# EAGLE design BC840M (EAGLE 9.6.2)

## Sheet 1 of 3
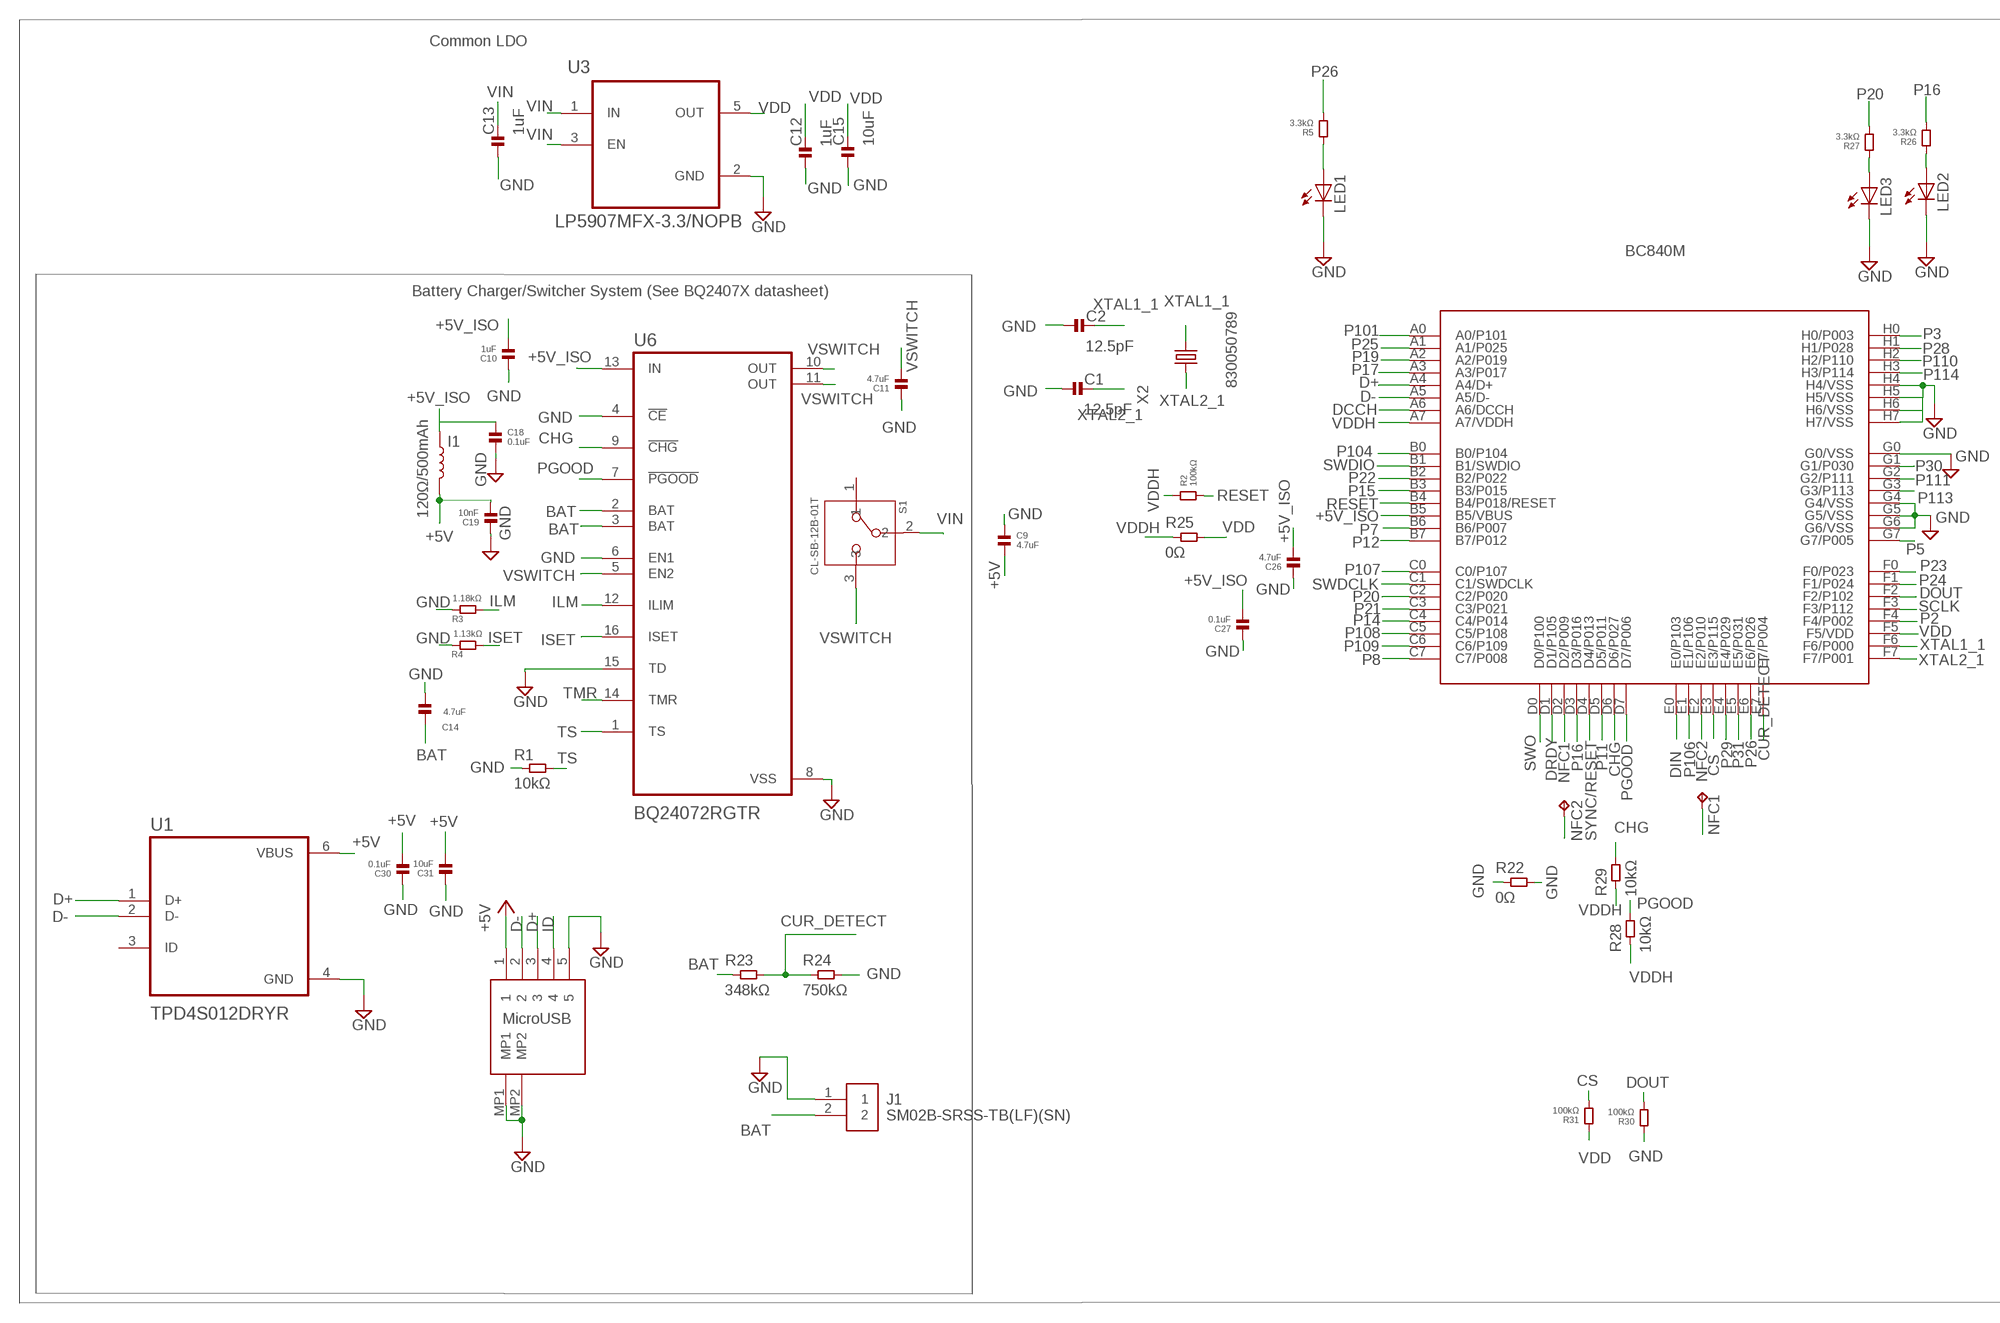
[diagram p0: schematic, sheet 1, part 1 of 2]
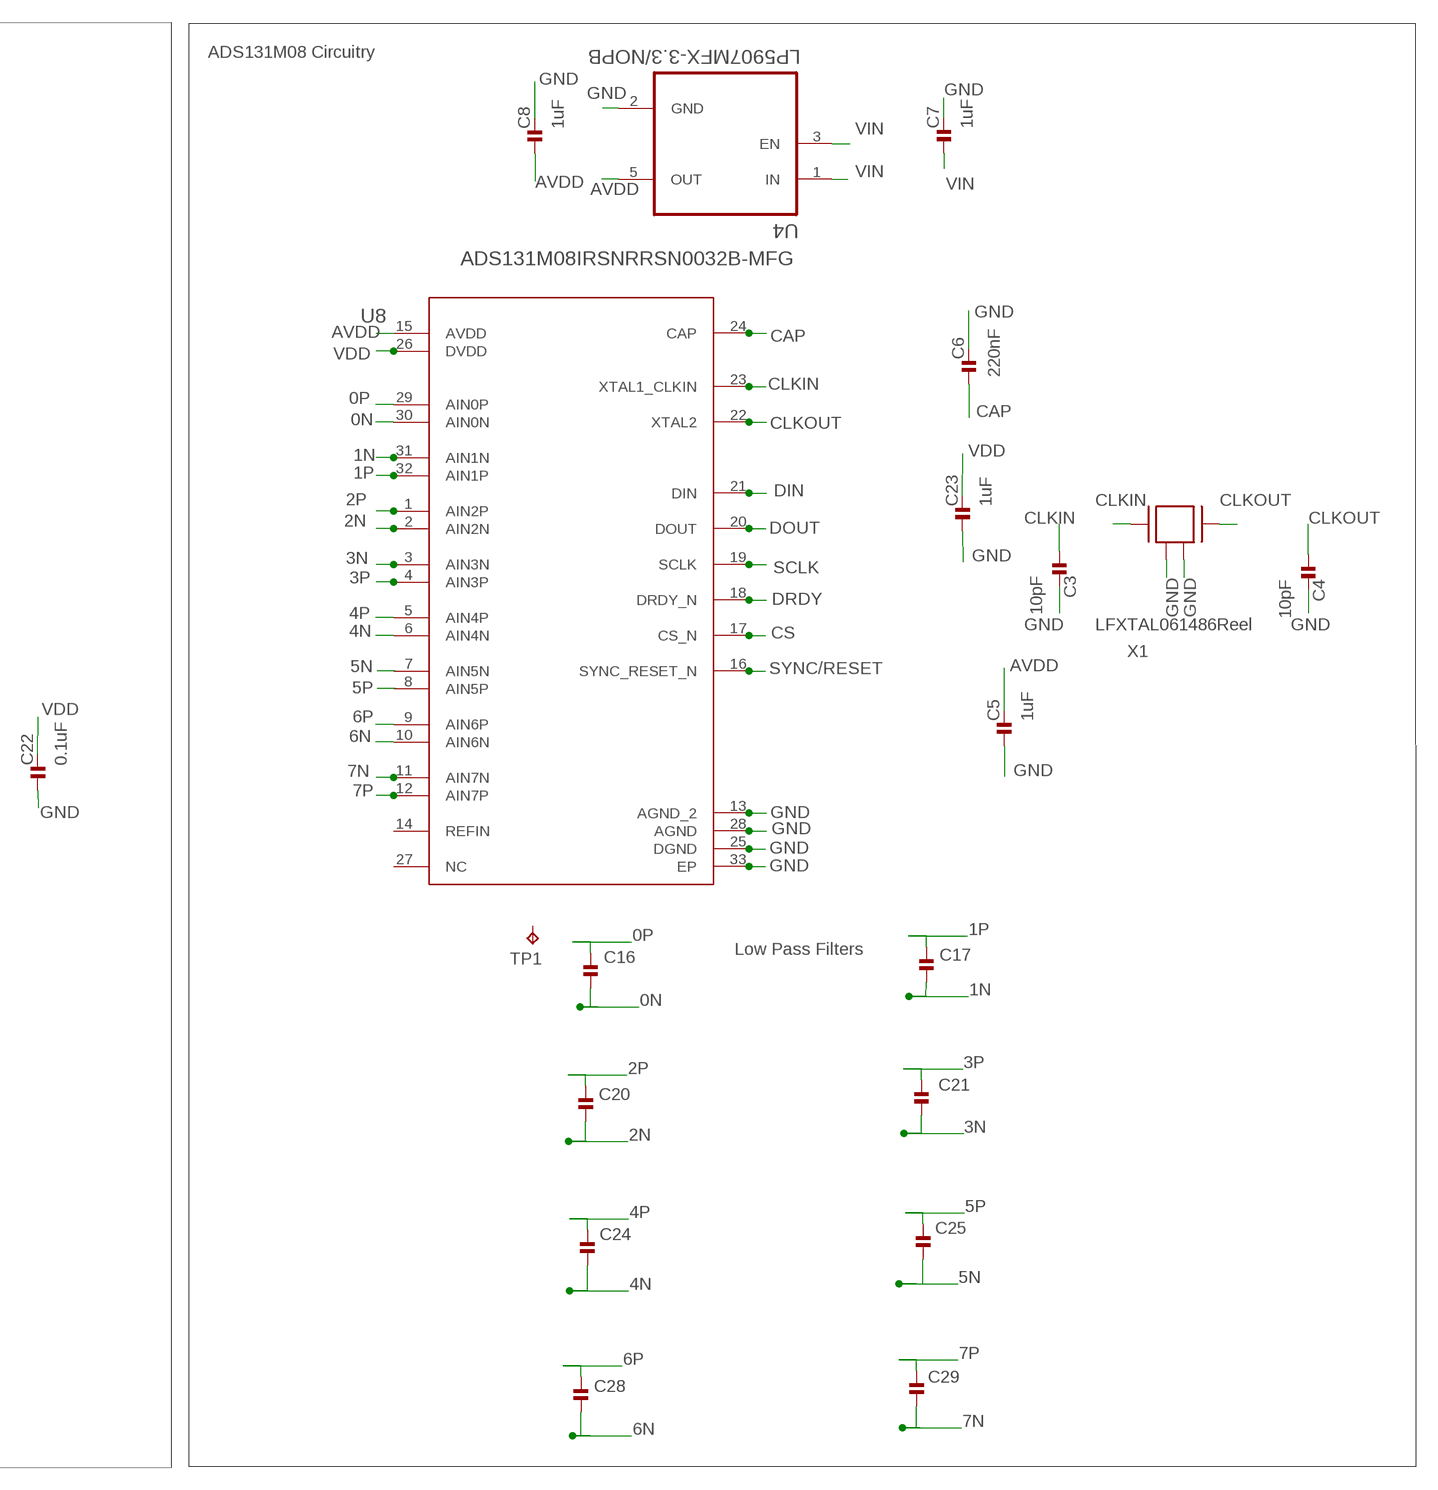
[diagram p1: schematic, sheet 1, part 2 of 2]

### Parts
C1  12.5pF  CAPACITOR.0201  [0201]
C2  12.5pF  CAPACITOR.0201  [0201]
C3  10pF  CAPACITOR.0201  [0201]
C4  10pF  CAPACITOR.0201  [0201]
C5  1uF  CAPACITOR.0201  [0201]
C6  220nF  CAPACITOR.0201  [0201]
C7  1uF  CAPACITOR.0201  [0201]
C8  1uF  CAPACITOR.0201  [0201]
C9  4.7uF  CAPACITOR.0201  [0201]
C10  1uF  CAPACITOR.0201  [0201]
C11  4.7uF  CAPACITOR.0201  [0201]
C12  1uF  CAPACITOR.0201  [0201]
C13  1uF  CAPACITOR.0201  [0201]
C14  4.7uF  CAPACITOR.0201  [0201]
C15  10uF  CAPACITOR.0402  [0402]
C16  100pF  CAPACITOR.0201  [0201]
C17  100pF  CAPACITOR.0201  [0201]
C18  0.1uF  CAPACITOR.0201  [0201]
C19  10nF  CAPACITOR.0201  [0201]
C20  100pF  CAPACITOR.0201  [0201]
C21  100pF  CAPACITOR.0201  [0201]
C22  0.1uF  CAPACITOR.0201  [0201]
C23  1uF  CAPACITOR.0201  [0201]
C24  100pF  CAPACITOR.0201  [0201]
C25  100pF  CAPACITOR.0201  [0201]
C26  4.7uF  CAPACITOR.0201  [0201]
C27  0.1uF  CAPACITOR.0201  [0201]
C28  100pF  CAPACITOR.0201  [0201]
C29  100pF  CAPACITOR.0201  [0201]
C30  0.1uF  CAPACITOR.0201  [0201]
C31  10uF  CAPACITOR.0402  [0402]
I1  120Ω/500mAh  12NH-0402  [0402_COILCRAFT]
J1  SM02B-SRSS-TB(LF)(SN)  [SM02B-SRSS-TB(LF)(SN)]
LED1  LEDCHIPLED_0603  [CHIPLED_0603]
LED2  LEDCHIPLED_0603  [CHIPLED_0603]
LED3  LEDCHIPLED_0603  [CHIPLED_0603]
NFC1  TPTP14SQ  [TP14SQ]
NFC2  TPTP14SQ  [TP14SQ]
R1  10kΩ  RESISTOR.0201  [0201]
R2  100kΩ  RESISTOR.0201  [0201]
R3  1.18kΩ  RESISTOR.0603  [0603]
R4  1.13kΩ  RESISTOR.0603  [0603]
R5  3.3kΩ  RESISTOR.0201  [0201]
R22  0Ω  RESISTOR.0805  [0805]
R23  348kΩ  RESISTOR.0603  [0603]
R24  750kΩ  RESISTOR.0603  [0603]
R25  0Ω  RESISTOR.0805  [0805]
R26  3.3kΩ  RESISTOR.0201  [0201]
R27  3.3kΩ  RESISTOR.0201  [0201]
R28  10kΩ  RESISTOR.0402  [0402]
R29  10kΩ  RESISTOR.0402  [0402]
R30  100kΩ  RESISTOR.0402  [0402]
R31  100kΩ  RESISTOR.0402  [0402]
S1  CL-SB-12B-01T  [CL-SB-12B]
TP1  TPTP15R  [TP15R]
U1  TPD4S012DRYR  [PSON50P145X100X60-6N]
U2  BC840M  [BC840M]
U3  LP5907MFX-3.3/NOPB  [SOT95P280X145-5N]
U4  LP5907MFX-3.3/NOPB  [SOT95P280X145-5N]
U6  BQ24072RGTR  [QFN50P300X300X100-17N]
U7  DX4R005JJ2R1800  [DX4R005JJ2R1800]
U8  ADS131M08IRSNRRSN0032B-MFG  [RSN0032B-MFG]
X1  ABM3B-8.000MHZ-B2-T  [ABM3B-8.000MHZ-B2-T]
X2  FC-12M  [FC-12M]

### Nets
0N: C16.2 U8.30(AIN0N)
0P: C16.1 U8.29(AIN0P)
1N: C17.2 U8.31(AIN1N)
1P: C17.1 U8.32(AIN1P)
2N: C20.2 U8.2(AIN2N)
2P: C20.1 U8.1(AIN2P)
3N: C21.2 U8.3(AIN3N)
3P: C21.1 U8.4(AIN3P)
4N: C24.2 U8.6(AIN4N)
4P: C24.1 U8.5(AIN4P)
5N: C25.2
5P: C25.1
6N: C28.2 U8.10(AIN6N)
6P: C28.1 U8.9(AIN6P)
7N: C29.2 U8.11(AIN7N)
7P: C29.1 U8.12(AIN7P)
+5V: C9.2 C19.2 C30.2 C31.2 I1.P$2 U1.6(VBUS) U7.1
+5V_ISO: C10.2 C18.1 C26.2 C27.2 I1.P$1 U2.B5(B5/VBUS) U6.13(IN)
AVDD: C5.2 C8.1 U4.5(OUT) U8.15(AVDD)
BAT: C14.2 J1.2 R23.1 U6.2(BAT) U6.3(BAT)
CAP: C6.1 U8.24(CAP)
CHG: R29.2 U2.D6(D6/P027) U6.9(!CHG)
CLKIN: C3.1 U8.23(XTAL1_CLKIN) X1.1
CLKOUT: C4.1 U8.22(XTAL2) X1.3
CS: R31.1 U2.E3(E3/P115) U8.17(CS_N)
CUR_DETECT: R23.2 R24.1 U2.E7(E7/P004)
D+: U1.1(D+) U2.A4(A4/D+) U7.3
D-: U1.2(D-) U2.A5(A5/D-) U7.2
DCCH: U2.A6(A6/DCCH)
DIN: U2.E0(E0/P103) U8.21(DIN)
DOUT: R30.1 U2.F2(F2/P102) U8.20(DOUT)
DRDY: U2.D1(D1/P105) U8.18(DRDY_N)
GND: C1.1 C2.1 C3.2 C4.2 C5.1 C6.2 C7.2 C8.2 C9.1 C10.1 C11.1 C12.1 C13.1 C14.1 C15.1 C18.2 C19.1 C22.1 C23.1 C26.1 C27.1 C30.1 C31.1 J1.1 LED1.C LED2.C LED3.C R1.1 R3.1 R4.1 R22.1 R22.2 R24.2 R30.2 U1.4(GND) U2.G0(G0/VSS) U2.G4(G4/VSS) U2.G5(G5/VSS) U2.G6(G6/VSS) U2.H4(H4/VSS) U2.H5(H5/VSS) U2.H6(H6/VSS) U2.H7(H7/VSS) U3.2(GND) U4.2(GND) U6.4(!CE) U6.6(EN1) U6.8(VSS) U6.15(TD) U7.5 U7.MP1 U7.MP2 U8.13(AGND_2) U8.25(DGND) U8.28(AGND) U8.33(EP) X1.2 X1.4
ID: U7.4
ILM: R3.2 U6.12(ILIM)
ISET: R4.2 U6.16(ISET)
LED1: LED1.A R5.2
LED2: LED2.A R26.2
LED3: LED3.A R27.2
NFC1: NFC2.TP U2.D2(D2/P009)
NFC2: NFC1.TP U2.E2(E2/P010)
P2: U2.F4(F4/P002)
P3: U2.H0(H0/P003)
P5: U2.G7(G7/P005)
P7: U2.B6(B6/P007)
P8: U2.C7(C7/P008)
P11: U2.D5(D5/P011)
P12: U2.B7(B7/P012)
P14: U2.C4(C4/P014)
P15: U2.B3(B3/P015)
P16: R26.1 U2.D3(D3/P016)
P17: U2.A3(A3/P017)
P19: U2.A2(A2/P019)
P20: R27.1 U2.C2(C2/P020)
P21: U2.C3(C3/P021)
P22: U2.B2(B2/P022)
P23: U2.F0(F0/P023)
P24: U2.F1(F1/P024)
P25: U2.A1(A1/P025)
P26: R5.1 U2.E6(E6/P026)
P28: U2.H1(H1/P028)
P29: U2.E4(E4/P029)
P30: U2.G1(G1/P030)
P31: U2.E5(E5/P031)
P101: U2.A0(A0/P101)
P104: U2.B0(B0/P104)
P106: U2.E1(E1/P106)
P107: U2.C0(C0/P107)
P108: U2.C5(C5/P108)
P109: U2.C6(C6/P109)
P110: U2.H2(H2/P110)
P111: U2.G2(G2/P111)
P113: U2.G3(G3/P113)
P114: U2.H3(H3/P114)
PGOOD: R28.2 U2.D7(D7/P006) U6.7(!PGOOD)
RESET: R2.1 U2.B4(B4/P018/RESET)
SCLK: U2.F3(F3/P112) U8.19(SCLK)
SWDCLK: U2.C1(C1/SWDCLK)
SWDIO: U2.B1(B1/SWDIO)
SWO: U2.D0(D0/P100)
SYNC/RESET: U2.D4(D4/P013) U8.16(SYNC_RESET_N)
TMR: U6.14(TMR)
TS: R1.2 U6.1(TS)
VDD: C12.2 C15.2 C22.2 C23.2 R25.2 R31.2 U2.F5(F5/VDD) U3.5(OUT) U8.26(DVDD)
VDDH: R2.2 R25.1 R28.1 R29.1 U2.A7(A7/VDDH)
VIN: C7.1 C13.2 S1.2 U3.1(IN) U3.3(EN) U4.1(IN) U4.3(EN)
VSWITCH: C11.2 S1.3 U6.5(EN2) U6.10(OUT) U6.11(OUT)
XTAL1_1: C2.2 U2.F6(F6/P000) X2.2
XTAL2_1: C1.2 U2.F7(F7/P001) X2.1
Unconnected: S1.1 TP1.TP U1.3(ID) U8.7(AIN5N) U8.8(AIN5P) U8.14(REFIN) U8.27(NC)

### Notes on the sheet
- Common LDO
- ADS131M08 Circuitry
- BC840M
- Battery Charger/Switcher System (See BQ2407X datasheet)
- 830050789
- LFXTAL061486Reel
- Low Pass Filters
- MicroUSB

## Sheet 2 of 3

## Sheet 3 of 3

## Library data of the parts
C1-C31 = standardparts:CAPACITOR
I1 = spkfncoils:12NH; MOUSER_PART: 994-0402HP-12NXGLU; PROD_ID: NDUC-15271; VALUE: 12nH
J1 = SM02B-SRSS-TB_LF__SN_:SM02B-SRSS-TB(LF)(SN): JST (JAPAN SOLDERLESS TERMINALS) - SM02B-SRSS-TB (LF)(SN) - HEADER, R/A, 2WAY Source: Datasheet <http://www.jst-mfg.com/product/pdf/eng/eSH.pdf> Check prices <https://pricing.snapeda.com/parts/SM02B-SRSS-TB%28LF%29%28SN%29/JST%20Sales/view-part?ref=eda>; AVAILABILITY: In Stock; DESCRIPTION: Connector Header Surface Mount, Right Angle 2 position 0.039 (1.00mm); MF: JST Sales; MP: SM02B-SRSS-TB(LF)(SN); PACKAGE: None; PRICE: None
LED1-LED3 = adafruit:LED: LED OSRAM: - CHIPLED LG R971, LG N971, LY N971, LG Q971, LY Q971, LO R971, LY R971 LH N974, LH R974 LS Q976, LO Q976, LY Q976 LO Q996 - Hyper CHIPLED LW Q18S LB Q993, LB Q99A, LB R99A - SideLED LS A670, LO A670, LY A670, LG A670, LP A670 LB A673, LV A673, LT A673, LW A673 LH A674 LY A675 LS A676, LA A676, LO A676, LY A676, LW A676 LS A679, LY A679, LG A679 - Hyper Micro SIDELED® LS Y876, LA Y876, LO Y876, LY Y876 LT Y87S - SmartLED LW L88C, LW L88S LB L89C, LB L89S, LG L890 LS L89K, LO L89K, LY L89K LS L896, LA L896, LO L896, LY L896 - TOPLED LS T670, LO T670, LY T670, LG T670, LP T670 LSG T670, LSP T670, LSY T670, LOP T670, LYG T670 LG T671, LOG T671, LSG T671 LB T673, LV T673, LT T673, LW T673 LH T674 LS T676, LA T676, LO T676, LY T676, LB T676, LH T676, LSB T676, LW T676 LB T67C, LV T67C, LT T67C, LS T67K, LO T67K, LY T67K, LW E67C LS E67B, LA E67B, LO E67B, LY E67B, LB E67C, LV E67C, LT E67C LW T67C LS T679, LY T679, LG T679 LS T770, LO T770, LY T770, LG T770, LP T770 LB T773, LV T773, LT T773, LW T773 LH T774 LS E675, LA E675, LY E675, LS T675 LS T776, LA T776, LO T776, LY T776, LB T776 LHGB T686 LT T68C, LB T68C - Hyper Mini TOPLED® LB M676 - Mini TOPLED Santana® LG M470 LS M47K, LO M47K, LY M47K Source: http://www.osram.convergy.de/
NFC1 NFC2 TP1 = testpad:TP: Test pad
R1 R2 R4 R5 R22-R31 = standardparts:RESISTOR
R3 = standardparts:RESISTOR; SPICEPREFIX: R
S1 = CL-SB-12B-01T:CL-SB-12B-01T: Check prices <https://pricing.snapeda.com/parts/CL-SB-12B-01T/Nidec%20Copal/view-part?ref=eda>; AVAILABILITY: In Stock; DESCRIPTION: Slide Switch SPDT Surface Mount; MF: Nidec Copal; MP: CL-SB-12B-01T; PACKAGE: None; PRICE: None
U1 = TPD4S012DRYR:TPD4S012DRYR: Check prices <https://pricing.snapeda.com/parts/TPD4S012DRYR/Texas%20Instruments/view-part?ref=eda>; AVAILABILITY: In Stock; DESCRIPTION: 4-channel USB ESD solution with power clamp 6-SON -40 to 85; MF: Texas Instruments; MP: TPD4S012DRYR; PACKAGE: USON-6 Texas Instruments; PRICE: None; PURCHASE-URL: https://pricing.snapeda.com/search/part/TPD4S012DRYR/?ref=eda
U2 = BC840M:BC840M: Check prices <https://pricing.snapeda.com/parts/BC840M/Fanstel%20Corp./view-part?ref=eda>; AVAILABILITY: In Stock; DESCRIPTION: 802.15.4, Bluetooth Bluetooth v5.0, Thread, Zigbee® Transceiver Module 2.4GHz PCB Trace Surface Mount; MF: Fanstel Corp.; MP: BC840M; PACKAGE: None; PRICE: None; PURCHASE-URL: https://pricing.snapeda.com/search/part/BC840M/?ref=eda
U3 U4 = LP5907MFX-3.3_NOPB:LP5907MFX-3.3/NOPB: IC REG LINEAR 3.3V 250MA SOT23; AVAILABILITY: Unavailable; DESCRIPTION: Linear Voltage Regulator IC 1 Output 250mA SOT-23-5; MF: Texas Instruments; MP: LP5907MFX-3.3/NOPB; PACKAGE: SOT-23 Texas Instruments; PRICE: None
U6 = BQ24072RGTR:BQ24072RGTR: Check prices <https://pricing.snapeda.com/parts/BQ24072RGTR/Texas%20Instruments/view-part?ref=eda>; AVAILABILITY: In Stock; DESCRIPTION: Standalone 1-cell 1.5-A linear charger, Power Path, 4.2-V VBAT and VOUT=VBAT + 225mV 16-VQFN -40 to 85; MF: Texas Instruments; MP: BQ24072RGTR; PACKAGE: VQFN-16 Texas Instruments; PRICE: None; PURCHASE-URL: https://pricing.snapeda.com/search/part/BQ24072RGTR/?ref=eda
U7 = DX4R005JJ2R1800:DX4R005JJ2R1800: Check prices <https://pricing.snapeda.com/parts/DX4R005JJ2R1800/JAE%20Electronics/view-part?ref=eda>; AVAILABILITY: In Stock; DESCRIPTION: USB - micro B USB 2.0 Receptacle Connector 5 Position Surface Mount, Right Angle; Through Hole; MF: JAE Electronics; MP: DX4R005JJ2R1800; PACKAGE: None; PRICE: None
U8 = ads131m08irsnr:ADS131M08IRSNR; COPYRIGHT: Copyright (C) 2022 Ultra Librarian. All rights reserved.; MANUFACTURER_PART_NUMBER: ADS131M08IRSNR; MFR_NAME: Texas Instruments; REFDES: RefDes; TYPE: TYPE
X1 = Crystals_Oscillators:ABM3B-8.000MHZ-B2-T: CRYSTAL 8.0000MHZ 18PF SMD Manufacturer's datasheet <https://abracon.com/Resonators/abm3b.pdf>; CREATED_BY: PCBLayout.com; DIGIKEY_PART_NUMBER: 535-9720-2-ND; MANUFACTURER: Abracon LLC; MPN: ABM3B-8.000MHZ-B2-T; PACKAGE: SMD 4
X2 = crystal:FC-12M: kHz RANGE CRYSTAL UNIT LOW PROFILE SMD Source: Epson Toyocom FC-12M.pdf

## Board
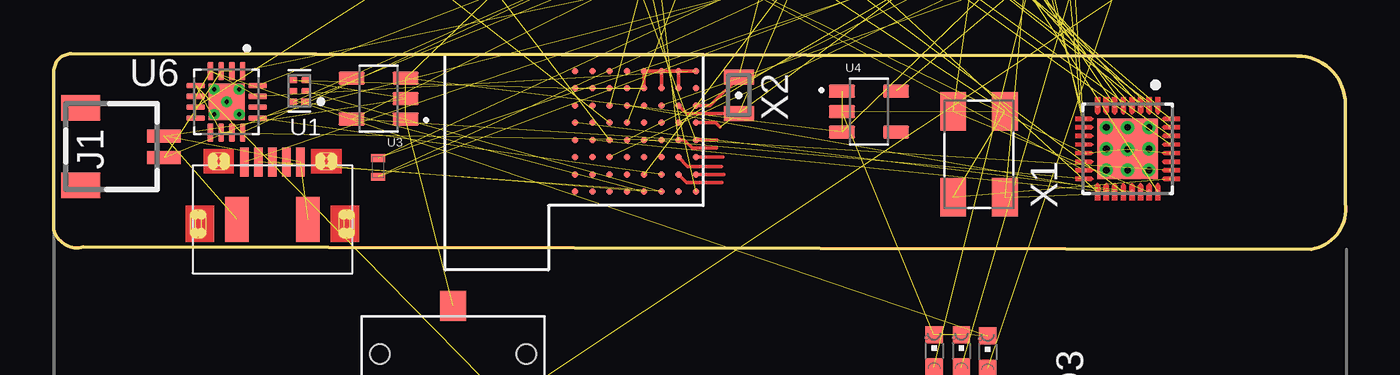
[diagram p2: board, top side]
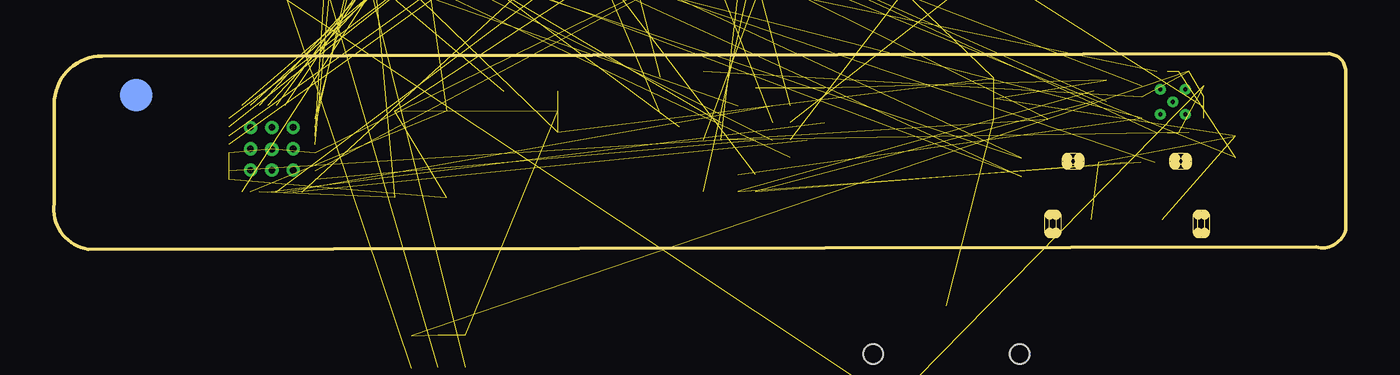
[diagram p3: board, bottom side, seen from below]

Size 60.01 x 9.09 mm. Coordinates in mm from the lower left corner, seen from the top.
Outline: 57.76,8.99 arc-90 60,6.76 60,2.13 arc-90 58.42,0 1.37,0.1 arc-90 0,0.91 0,8.28 arc-90 0.81,9.09 57.76,8.99
Copper layers (1*16): Top 0.035mm / dielectric 1.5mm / Bottom 0.035mm
Design rules "default *": minimum track width 4mil, minimum drill 0.2mm, track to track 6mil, track to pad 6mil, pad to pad 6mil, via to via 6mil, smd to smd 6mil, copper to edge 10mil, drill to drill 6mil, minimum pad ring 6mil, minimum via ring 6mil, stop-mask expansion 4mil, vias tented up to drill 20mil, thermal gap 10mil

### Footprints (pad centres in the part's own frame; a part is rotated, then mirrored left to right if it is on the bottom)
0201 = smd 0.25 x 0.35: 1 -0.325,0; 2 0.325,0
0402 = smd 0.5 x 0.6: 1 -0.55,0; 2 0.55,0
0402_COILCRAFT = smd 0.356 x 0.66: P$1 -0.432,0; P$2 0.432,0
SM02B-SRSS-TB(LF)(SN) = smd 0.6 x 1.55: 1 -0.5,1.975; 2 0.5,1.975 | smd 1.2 x 1.8: 3 -1.8,-1.9; 4 1.8,-1.9
CHIPLED_0603 = smd 0.8 x 0.8: A 0,-0.75; C 0,0.75
TP14SQ = smd 1.4 x 1.4: TP 0,0
0603 = smd 0.65 x 1: 1 -0.775,0; 2 0.775,0
0805 = smd 1.2 x 1.4: 1 -1.3,0; 2 1.3,0
CL-SB-12B = smd 1.2 x 1.4: 1 -2.5,-2.25; 2 0,2.25; 3 2.5,-2.25 | hole 0.9: 3.4,0; -3.4,0
TP15R = smd 1.5 x 1.5: TP 0,0
PSON50P145X100X60-6N = smd 0.42 x 0.3: 1 -0.29,0.5 | smd 0.41 x 0.3: 2 -0.295,0; 3 -0.295,-0.5; 4 0.295,-0.5; 5 0.295,0; 6 0.295,0.5
BC840M = smd 0.305 x 0.305: A0 0.66,5.966; A1 0.66,5.153; A2 0.66,4.366; A3 0.66,3.553; A4 0.66,2.765; A5 0.66,1.953; A6 0.66,1.165; A7 0.66,0.352; B0 1.448,5.966; B1 1.448,5.153; B2 1.448,4.366; B3 1.448,3.553; B4 1.448,2.765; B5 1.448,1.953; B6 1.448,1.165; B7 1.448,0.352; C0 2.261,5.966; C1 2.261,5.153; C2 2.261,4.366; C3 2.261,3.553; C4 2.261,2.765; C5 2.261,1.953; C6 2.261,1.165; C7 2.261,0.352; D0 3.048,5.966; D1 3.048,5.153; D2 3.048,4.366; D3 3.048,3.553; D4 3.048,2.765; D5 3.048,1.953; D6 3.048,1.165; D7 3.048,0.352; E0 3.861,5.966; E1 3.861,5.153; E2 3.861,4.366; E3 3.861,3.553; E4 3.861,2.765; E5 3.861,1.953; E6 3.861,1.165; E7 3.861,0.352; F0 4.648,5.966; F1 4.648,5.153; F2 4.648,4.366; F3 4.648,3.553; F4 4.648,2.765; F5 4.648,1.953; F6 4.648,1.165; F7 4.648,0.352; G0 5.461,5.966; G1 5.461,5.153; G2 5.461,4.366; G3 5.461,3.553; G4 5.461,2.765; G5 5.461,1.953; G6 5.461,1.165; G7 5.461,0.352; H0 6.248,5.966; H1 6.248,5.153; H2 6.248,4.366; H3 6.248,3.553; H4 6.248,2.765; H5 6.248,1.953; H6 6.248,1.165; H7 6.248,0.352
SOT95P280X145-5N = smd 1.21 x 0.59: 1 -1.255,0.95; 2 -1.255,0; 3 -1.255,-0.95; 4 1.255,-0.95; 5 1.255,0.95
QFN50P300X300X100-17N = smd 0.86 x 0.26: 1 -1.435,0.75; 2 -1.435,0.25; 3 -1.435,-0.25; 4 -1.435,-0.75; 9 1.435,-0.75; 10 1.435,-0.25; 11 1.435,0.25; 12 1.435,0.75 | smd 0.26 x 0.86: 5 -0.75,-1.435; 6 -0.25,-1.435; 7 0.25,-1.435; 8 0.75,-1.435; 13 0.75,1.435; 14 0.25,1.435; 15 -0.25,1.435; 16 -0.75,1.435 | smd 1.68 x 1.68: 17 0,0 | drill 0.2 pad 0.4: 18 0,0; 19 -0.58,0.58; 20 0.58,0.58; 21 -0.58,-0.58; 22 0.58,-0.58
DX4R005JJ2R1800 = smd 1.35 x 0.4: 1 1.525,1.3; 2 1.525,0.65; 3 1.525,0; 4 1.525,-0.65; 5 1.525,-1.3 | smd 2.1 x 1.1: MP1 -1.15,1.65; MP2 -1.15,-1.65
RSN0032B-MFG = smd 0.18 x 0.18: 1 -2.01,1.4; 2 -2.01,1; 3 -2.01,0.6; 4 -2.01,0.2; 5 -2,-0.2; 6 -2,-0.6; 7 -2,-1; 8 -2,-1.4; 9 -1.4,-2.01; 10 -1,-2.01; 11 -0.6,-2.01; 12 -0.2,-2.01; 13 0.2,-2; 14 0.6,-2; 15 1,-2; 16 1.4,-2; 17 2.01,-1.4; 18 2.01,-1; 19 2.01,-0.6; 20 2.01,-0.2; 21 2,0.2; 22 2,0.6; 23 2,1; 24 2,1.4; 25 1.4,2.01; 26 1,2.01; 27 0.6,2.01; 28 0.2,2.01; 29 -0.2,2; 30 -0.6,2; 31 -1,2; 32 -1.4,2 | smd 2.8 x 2.8: 33 0,0 | drill 0.305 pad 0.61: 34 -0.991,-0.991; 35 -0.991,0; 36 -0.991,0.991; 37 0,-0.991; 38 0.025,0; 39 0,0.991; 40 0.991,-0.991; 41 0.991,0; 42 0.991,0.991
ABM3B-8.000MHZ-B2-T = smd 1.8 x 1.2: 1 -2,-1.2; 2 2,-1.2; 3 2,1.2; 4 -2,1.2
FC-12M = smd 0.7 x 1.4: 1 -0.85,0; 2 0.85,0

### Placement (x,y rotation side)
C1  34.19,18.44 0 top  (outside the outline)
C2  36.63,18.44 0 top  (outside the outline)
C3  43.79,18.44 0 top  (outside the outline)
C4  45.97,18.44 0 top  (outside the outline)
C5  20.73,17.98 0 top  (outside the outline)
C6  41.45,18.44 0 top  (outside the outline)
C7  50.34,18.44 0 top  (outside the outline)
C8  52.53,18.44 0 top  (outside the outline)
C9  54.71,18.44 0 top  (outside the outline)
C10  56.9,18.44 0 top  (outside the outline)
C11  59.08,18.44 0 top  (outside the outline)
C12  61.26,18.44 0 top  (outside the outline)
C13  23.98,15.65 0 top  (outside the outline)
C14  26.16,15.65 0 top  (outside the outline)
C15  57.1,21.54 0 top  (outside the outline)
C16  24.64,24.59 0 top  (outside the outline)
C17  27.74,24.59 0 top  (outside the outline)
C18  28.35,15.65 0 top  (outside the outline)
C19  30.53,15.65 0 top  (outside the outline)
C20  30.84,24.59 0 top  (outside the outline)
C21  33.93,24.59 0 top  (outside the outline)
C22  32.72,15.65 0 top  (outside the outline)
C23  34.9,15.65 0 top  (outside the outline)
C24  37.03,24.59 0 top  (outside the outline)
C25  40.13,24.59 0 top  (outside the outline)
C26  37.08,15.65 0 top  (outside the outline)
C27  39.27,15.65 0 top  (outside the outline)
C28  43.23,24.59 0 top  (outside the outline)
C29  46.33,24.59 0 top  (outside the outline)
C30  41.45,15.65 0 top  (outside the outline)
C31  59.64,21.54 0 top  (outside the outline)
I1  15.06,3.81 270 top
J1  3.15,4.78 270 top
LED1  40.89,-4.72 0 top  (outside the outline)
LED2  42.16,-4.72 0 top  (outside the outline)
LED3  43.38,-4.78 0 top  (outside the outline)
NFC1  16.31,13.36 0 top  (outside the outline)
NFC2  19.46,13.41 0 top  (outside the outline)
R1  43.64,15.65 0 top  (outside the outline)
R2  39.07,18.44 0 top  (outside the outline)
R3  49.43,24.59 0 top  (outside the outline)
R4  52.53,24.59 0 top  (outside the outline)
R5  45.82,15.65 0 top  (outside the outline)
R22  54.81,29.21 0 top  (outside the outline)
R23  55.63,24.59 0 top  (outside the outline)
R24  58.72,24.59 0 top  (outside the outline)
R25  59.49,29.21 0 top  (outside the outline)
R26  48.01,15.65 0 top  (outside the outline)
R27  50.19,15.65 0 top  (outside the outline)
R28  24.38,18.29 0 top  (outside the outline)
R29  26.92,18.29 0 top  (outside the outline)
R30  29.46,18.29 0 top  (outside the outline)
R31  32,18.29 0 top  (outside the outline)
S1  18.54,-4.88 0 top
TP1  56.18,7.16 0 bottom
U1  11.4,7.37 180 top
U2  30.18,2.03 90 top
U3  15.09,7.01 180 top
U4  37.87,6.4 0 top
U6  8.03,6.86 270 top
U7  10.16,2.54 90 top
U8  49.89,4.67 270 top
X1  42.98,4.42 270 top
X2  31.83,7.16 270 top

### Tracks (layer width: path | path; a pad name or v marks a point on that pad's centre or on a via)
0N  (1 unrouted)
0P  (1 unrouted)
1N  (1 unrouted)
1P  (1 unrouted)
2N  (1 unrouted)
2P  (1 unrouted)
3N  (1 unrouted)
3P  (1 unrouted)
4N  (1 unrouted)
4P  (1 unrouted)
6N  (1 unrouted)
6P  (1 unrouted)
7N  (1 unrouted)
7P  (1 unrouted)
+5V  (6 unrouted)
+5V_ISO  (6 unrouted)
AVDD  (3 unrouted)
BAT  (4 unrouted)
CAP  (1 unrouted)
CHG  (2 unrouted)
  Top 0.152: U2.D6 29.28,5.08 29.66,4.7 30.78,4.7
CLKIN  (2 unrouted)
CLKOUT  (2 unrouted)
CS  (2 unrouted)
CUR_DETECT  (2 unrouted)
  Top 0.152: U2.E7 30.73,5.89 30.94,5.69
D+  (2 unrouted)
D-  (2 unrouted)
DIN  (1 unrouted)
DOUT  (2 unrouted)
DRDY  (1 unrouted)
GND  (51 unrouted)
  Top 0.152: U2.G6 U2.H6 | U2.H7 U2.H6 | U2.G5 U2.H5 | U2.H6 U2.H5 | U2.G4 U2.H4 U2.H5
ILM  (1 unrouted)
ISET  (1 unrouted)
LED1  (1 unrouted)
LED2  (1 unrouted)
LED3  (1 unrouted)
NFC1  (1 unrouted)
NFC2  (1 unrouted)
P7
  Top 0.152: U2.B6 29.39,3.1 31.04,3.1
P8
  Top 0.152: U2.C7 31.09,4.29
P12
  Top 0.152: U2.B7 31.14,3.48
P16  (1 unrouted)
P20  (1 unrouted)
P26  (1 unrouted)
P109
  Top 0.152: U2.C6 29.44,3.86 31.01,3.86
PGOOD  (2 unrouted)
  Top 0.152: U2.D7 30.81,5.08
RESET  (1 unrouted)
SCLK  (1 unrouted)
SYNC/RESET  (1 unrouted)
TS  (1 unrouted)
VDD  (8 unrouted)
VDDH  (4 unrouted)
VIN  (6 unrouted)
VSWITCH  (4 unrouted)
XTAL1_1  (1 unrouted)
  Top 0.152: X2.2 31.81,6.3 29.39,6.3 U2.F6
XTAL2_1  (1 unrouted)
  Top 0.152: U2.F7 30.49,6.68 X2.1